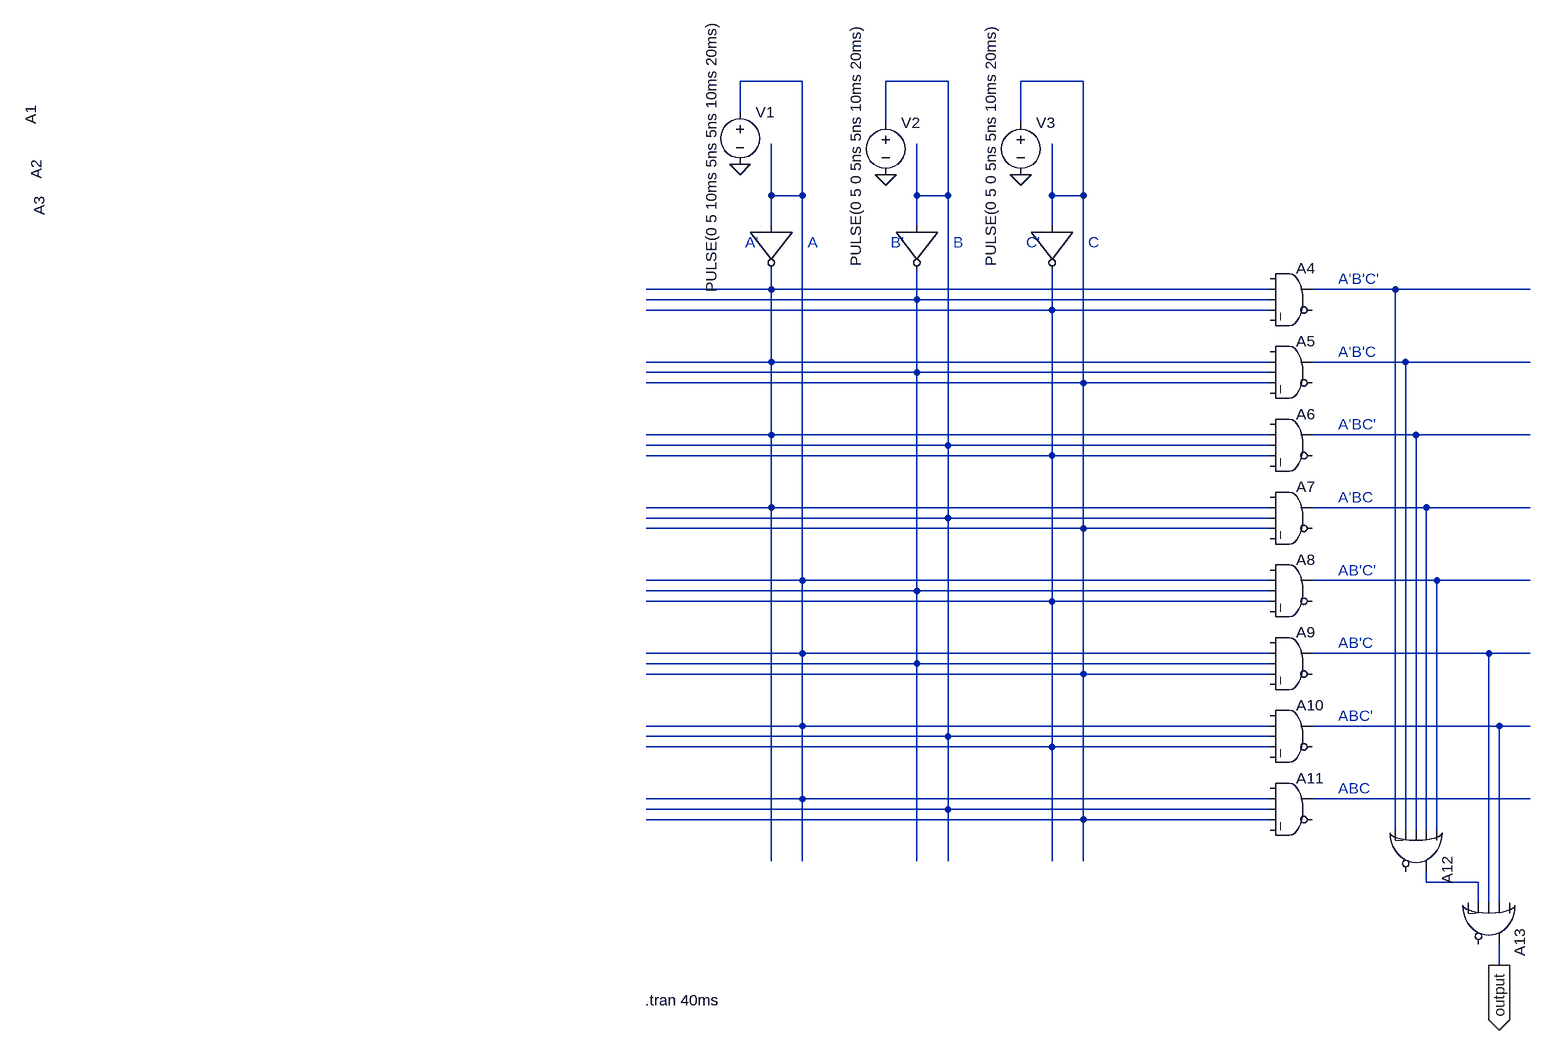
[diagram p0: schematic Circuit2_3 (1).asc]
Circuit2_3 (1).asc, the LTspice schematic file:
Version 4
SHEET 1 1956 1384
WIRE 112 -160 16 -160
WIRE 336 -160 240 -160
WIRE 544 -160 448 -160
WIRE 16 -112 16 -160
WIRE 240 -96 240 -160
WIRE 448 -96 448 -160
WIRE 64 16 64 -64
WIRE 112 16 112 -160
WIRE 112 16 64 16
WIRE 288 16 288 -64
WIRE 336 16 336 -160
WIRE 336 16 288 16
WIRE 496 16 496 -64
WIRE 544 16 544 -160
WIRE 544 16 496 16
WIRE 64 64 64 16
WIRE 288 64 288 16
WIRE 496 64 496 16
WIRE 64 160 64 128
WIRE 64 160 -128 160
WIRE 832 160 64 160
WIRE 1024 160 896 160
WIRE 1232 160 1024 160
WIRE 288 176 288 128
WIRE 288 176 -128 176
WIRE 832 176 288 176
WIRE 496 192 496 128
WIRE 496 192 -128 192
WIRE 832 192 496 192
WIRE 64 272 64 160
WIRE 64 272 -128 272
WIRE 832 272 64 272
WIRE 1040 272 896 272
WIRE 1232 272 1040 272
WIRE 288 288 288 176
WIRE 288 288 -128 288
WIRE 832 288 288 288
WIRE 544 304 544 16
WIRE 544 304 -128 304
WIRE 832 304 544 304
WIRE 64 384 64 272
WIRE 64 384 -128 384
WIRE 832 384 64 384
WIRE 1056 384 896 384
WIRE 1232 384 1056 384
WIRE 336 400 336 16
WIRE 336 400 -128 400
WIRE 832 400 336 400
WIRE 496 416 496 192
WIRE 496 416 -128 416
WIRE 832 416 496 416
WIRE 64 496 64 384
WIRE 64 496 -128 496
WIRE 832 496 64 496
WIRE 1072 496 896 496
WIRE 1232 496 1072 496
WIRE 336 512 336 400
WIRE 336 512 -128 512
WIRE 832 512 336 512
WIRE 544 528 544 304
WIRE 544 528 -128 528
WIRE 832 528 544 528
WIRE 112 608 112 16
WIRE 112 608 -128 608
WIRE 832 608 112 608
WIRE 1088 608 896 608
WIRE 1232 608 1088 608
WIRE 288 624 288 288
WIRE 288 624 -128 624
WIRE 832 624 288 624
WIRE 496 640 496 416
WIRE 496 640 -128 640
WIRE 832 640 496 640
WIRE 112 720 112 608
WIRE 112 720 -128 720
WIRE 832 720 112 720
WIRE 1168 720 896 720
WIRE 1232 720 1168 720
WIRE 288 736 288 624
WIRE 288 736 -128 736
WIRE 832 736 288 736
WIRE 544 752 544 528
WIRE 544 752 -128 752
WIRE 832 752 544 752
WIRE 112 832 112 720
WIRE 112 832 -128 832
WIRE 832 832 112 832
WIRE 1184 832 896 832
WIRE 1232 832 1184 832
WIRE 336 848 336 512
WIRE 336 848 -128 848
WIRE 832 848 336 848
WIRE 496 864 496 640
WIRE 496 864 -128 864
WIRE 832 864 496 864
WIRE 112 944 112 832
WIRE 112 944 -128 944
WIRE 832 944 112 944
WIRE 1232 944 896 944
WIRE 336 960 336 848
WIRE 336 960 -128 960
WIRE 832 960 336 960
WIRE 544 976 544 752
WIRE 544 976 -128 976
WIRE 832 976 544 976
WIRE 1024 992 1024 160
WIRE 1040 992 1040 272
WIRE 1056 992 1056 384
WIRE 1072 992 1072 496
WIRE 1088 992 1088 608
WIRE 64 1040 64 496
WIRE 112 1040 112 944
WIRE 288 1040 288 736
WIRE 336 1040 336 960
WIRE 496 1040 496 864
WIRE 544 1040 544 976
WIRE 1072 1072 1072 1056
WIRE 1152 1072 1072 1072
WIRE 1152 1104 1152 1072
WIRE 1168 1104 1168 720
WIRE 1184 1104 1184 832
WIRE 1184 1200 1184 1168
FLAG 16 -32 0
FLAG 240 -16 0
FLAG 448 -16 0
FLAG 1184 1200 output
IOPIN 1184 1200 Out
SYMBOL Digital\\inv 128 64 R90
WINDOW 0 -187 1203 Left 2
SYMATTR InstName A1
SYMBOL Digital\\inv 352 64 R90
WINDOW 0 -103 1419 Left 2
SYMATTR InstName A2
SYMBOL Digital\\inv 560 64 R90
WINDOW 0 -47 1622 Left 2
SYMATTR InstName A3
SYMBOL Digital\\or 1120 1024 R90
SYMATTR InstName A12
SYMBOL Digital\\or 1232 1136 R90
SYMATTR InstName A13
SYMBOL voltage 16 -128 R0
WINDOW 3 -44 -125 VRight 2
WINDOW 123 0 0 Left 0
WINDOW 39 0 0 Left 0
SYMATTR InstName V1
SYMATTR Value PULSE(0 5 10ms 5ns 5ns 10ms 20ms)
SYMBOL voltage 240 -112 R0
WINDOW 3 -46 -135 VRight 2
WINDOW 123 0 0 Left 0
WINDOW 39 0 0 Left 0
SYMATTR InstName V2
SYMATTR Value PULSE(0 5 0 5ns 5ns 10ms 20ms)
SYMBOL voltage 448 -112 R0
WINDOW 3 -46 -135 VRight 2
WINDOW 123 0 0 Left 0
WINDOW 39 0 0 Left 0
SYMATTR InstName V3
SYMATTR Value PULSE(0 5 0 5ns 5ns 10ms 20ms)
SYMBOL Digital\\and 864 112 R0
SYMATTR InstName A4
SYMBOL Digital\\and 864 224 R0
SYMATTR InstName A5
SYMBOL Digital\\and 864 336 R0
SYMATTR InstName A6
SYMBOL Digital\\and 864 448 R0
SYMATTR InstName A7
SYMBOL Digital\\and 864 560 R0
SYMATTR InstName A8
SYMBOL Digital\\and 864 672 R0
SYMATTR InstName A9
SYMBOL Digital\\and 864 784 R0
SYMATTR InstName A10
SYMBOL Digital\\and 864 896 R0
SYMATTR InstName A11
TEXT -130 1254 Left 2 !.tran 40ms
TEXT 936 144 Left 2 ;A'B'C'
TEXT 936 256 Left 2 ;A'B'C
TEXT 936 368 Left 2 ;A'BC'
TEXT 936 480 Left 2 ;A'BC
TEXT 936 592 Left 2 ;AB'C'
TEXT 936 704 Left 2 ;AB'C
TEXT 936 816 Left 2 ;ABC'
TEXT 936 928 Left 2 ;ABC
TEXT 120 88 Left 2 ;A
TEXT 344 88 Left 2 ;B
TEXT 552 88 Left 2 ;C
TEXT 24 88 Left 2 ;A'
TEXT 248 88 Left 2 ;B'
TEXT 456 88 Left 2 ;C'

The netlist it stands for:
* Circuit2_3 (1).asc
A1 N001 0 0 0 0 N004 0 0 BUF
A2 N002 0 0 0 0 N006 0 0 BUF
A3 N003 0 0 0 0 N007 0 0 BUF
A12 N011 N010 N009 N008 N005 0 N015 0 OR
A13 0 N013 N012 N015 0 0 output 0 OR
V1 N001 0 PULSE(0 5 10ms 5ns 5ns 10ms 20ms)
V2 N002 0 PULSE(0 5 0 5ns 5ns 10ms 20ms)
V3 N003 0 PULSE(0 5 0 5ns 5ns 10ms 20ms)
A4 0 N004 N006 N007 0 0 N005 0 AND
A5 0 N004 N006 N003 0 0 N008 0 AND
A6 0 N004 N002 N007 0 0 N009 0 AND
A7 0 N004 N002 N003 0 0 N010 0 AND
A8 0 N001 N006 N007 0 0 N011 0 AND
A9 0 N001 N006 N003 0 0 N012 0 AND
A10 0 N001 N002 N007 0 0 N013 0 AND
A11 0 N001 N002 N003 0 0 N014 0 AND
.tran 40ms
* A'B'C'
* A'B'C
* A'BC'
* A'BC
* AB'C'
* AB'C
* ABC'
* ABC
* A
* B
* C
* A'
* B'
* C'
.backanno
.end